# Altium schematic sheet power.SchDoc
size A
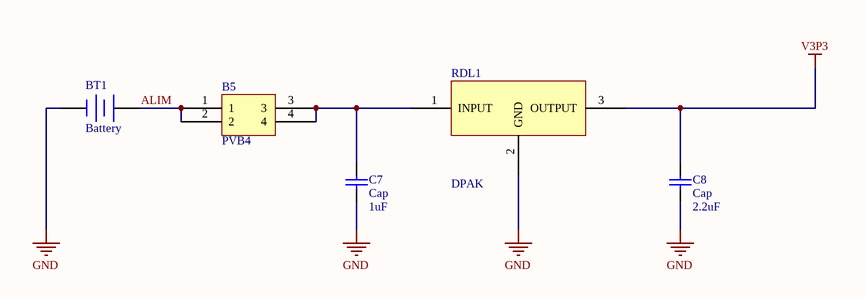
[diagram p0: power.SchDoc]

## Parts
B5  PVB4  [BUTTON ON/OFF]
BT1  Battery  [SUP_PILE]
C7  Cap  value 1uF  [Capacitor]
C8  Cap  value 2.2uF  [Capacitor]
RDL1  DPAK  [REG_DEC_LIN]

## Nets
GND: BT1.2(-) C7.1 C8.1 RDL1.2(GND)
V3P3: C8.2 RDL1.3(OUTPUT)
ALIM: B5.1 B5.2 BT1.1(+)
NetB5_3: B5.3 B5.4 C7.2 RDL1.1(INPUT)

## Library data of the parts
B5 = BUTTON_ON: Push switch ON/OFF; Ref. fournisseur: 2435330; Fournisseur: Farnell; Fabricant: C&K COMPONENTS; Ref. fabricant: PVB4 EE 300 NS LFS
BT1 = Battery: One-cell Battery AA; Fournisseur: Farnell; Ref. fournisseur: 1702629; Fabricant: KEYSTONE; Ref. fabricant: 2460; Published: 24-Mar-1999; LatestRevisionDate: 17-Jul-2002; LatestRevisionNote: Re-released for DXP Platform.; PackageReference: BAT-2; Publisher: Altium Limited; PackageDescription: Battery; 2 Leads
C7 C8 = Cap: Capacitor; Published: 8-Jun-2000; LatestRevisionDate: 17-Jul-2002; LatestRevisionNote: Re-released for DXP Platform.; PackageReference: RAD-0.3; Publisher: Altium Limited; PackageDescription: Radial Cap, Thru-Hole; 2 Leads; 0.3 in Pin Spacing